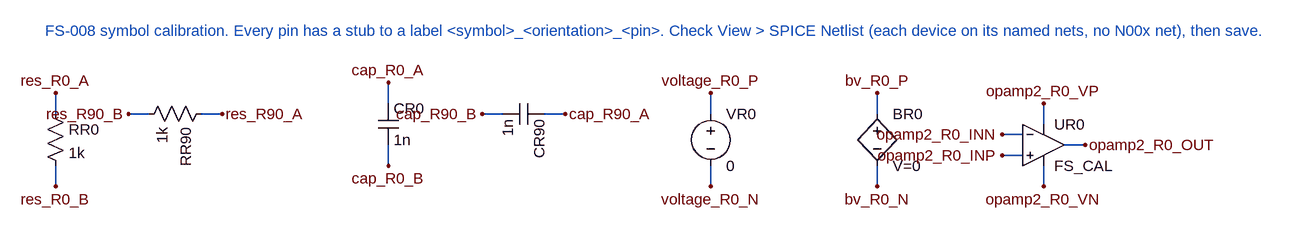
[diagram p0: schematic symbols.asc]
symbols.asc, the LTspice schematic file:
Version 4
SHEET 1 1920 320
WIRE 80 144 80 112
WIRE 80 224 80 256
WIRE 304 144 336 144
WIRE 224 144 192 144
WIRE 592 128 592 96
WIRE 592 192 592 224
WIRE 832 144 864 144
WIRE 768 144 736 144
WIRE 1088 144 1088 112
WIRE 1088 224 1088 256
WIRE 1344 144 1344 112
WIRE 1344 224 1344 256
WIRE 1568 208 1536 208
WIRE 1568 176 1536 176
WIRE 1600 160 1600 128
WIRE 1600 224 1600 256
WIRE 1632 192 1664 192
FLAG 80 112 res_R0_A
FLAG 80 256 res_R0_B
FLAG 336 144 res_R90_A
FLAG 192 144 res_R90_B
FLAG 592 96 cap_R0_A
FLAG 592 224 cap_R0_B
FLAG 864 144 cap_R90_A
FLAG 736 144 cap_R90_B
FLAG 1088 112 voltage_R0_P
FLAG 1088 256 voltage_R0_N
FLAG 1344 112 bv_R0_P
FLAG 1344 256 bv_R0_N
FLAG 1536 208 opamp2_R0_INP
FLAG 1536 176 opamp2_R0_INN
FLAG 1600 128 opamp2_R0_VP
FLAG 1600 256 opamp2_R0_VN
FLAG 1664 192 opamp2_R0_OUT
SYMBOL res 64 128 R0
SYMATTR InstName RR0
SYMATTR Value 1k
SYMBOL res 320 128 R90
SYMATTR InstName RR90
SYMATTR Value 1k
SYMBOL cap 576 128 R0
SYMATTR InstName CR0
SYMATTR Value 1n
SYMBOL cap 832 128 R90
SYMATTR InstName CR90
SYMATTR Value 1n
SYMBOL voltage 1088 128 R0
SYMATTR InstName VR0
SYMATTR Value 0
SYMBOL bv 1344 128 R0
SYMATTR InstName BR0
SYMATTR Value V=0
SYMBOL Opamps\\opamp2 1600 128 R0
SYMATTR InstName UR0
SYMATTR Value FS_CAL
TEXT 64 16 Left 2 ;FS-008 symbol calibration. Every pin has a stub to a label <symbol>_<orientation>_<pin>. Check View > SPICE Netlist (each device on its named nets, no N00x net), then save.

The netlist it stands for:
* symbols.asc
RR0 res_R0_A res_R0_B 1k
RR90 res_R90_A res_R90_B 1k
CR0 cap_R0_A cap_R0_B 1n
CR90 cap_R90_A cap_R90_B 1n
VR0 voltage_R0_P voltage_R0_N 0
BR0 bv_R0_P bv_R0_N V=0
XUR0 opamp2_R0_INP opamp2_R0_INN opamp2_R0_VP opamp2_R0_VN opamp2_R0_OUT FS_CAL  ; pins In+ In- V+ V- OUT
* FS-008 symbol calibration. Every pin has a stub to a label <symbol>_<orientation>_<pin>. Check View > SPICE Netlist (each device on its named nets, no N00x net), then save.
.backanno
.end